# Altium schematic sheet PSU.SchDoc
size A4; SheetNumber: 2; SheetTotal: 2
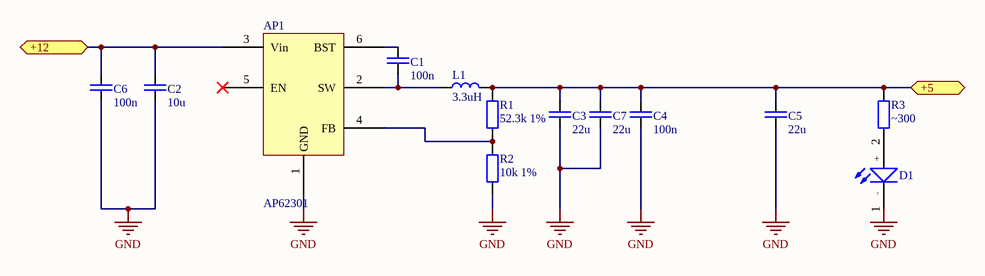
[diagram p0: PSU.SchDoc]

## Parts
AP1  AP62301  [SOT95P280X100-6L]
C1  100n  [C3216_1206I_L]
C2  10u  [C3225_1210I_L]
C3  22u  [C3225_1210I_L]
C4  100n  [C3216_1206I_L]
C5  22u  [C3225_1210I_L]
C6  100n  [C3216_1206I_L]
C7  22u  [C3225_1210I_L]
D1  LED  [LED1608_0603I_L]  (value not drawn)
L1  3.3uH  [INDUCTOR]
R1  52.3k 1%  [R1005_0402i_L]
R2  10k 1%  [R1005_0402i_L]
R3  ~300  [R1005_0402i_L]

## Ports
+5 (bidir), +12 (bidir)

## Nets
GND: AP1.1(GND) C2.2 C3.2 C4.2 C5.2 C6.2 C7.2 D1.1(-) R2.2
+5: C3.1 C4.1 C5.1 C7.1 L1.2 R1.1 R3.1 ; port +5
+12: AP1.3(Vin) C2.1 C6.1 ; port +12
NetAP1_2: AP1.2(SW) C1.2 L1.1
NetAP1_4: AP1.4(FB) R1.2 R2.1
NetAP1_6: AP1.6(BST) C1.1
NetD1_2: D1.2(+) R3.2

Not connected (* = marked no-connect by the designer): AP1 5(EN)*

## Library data of the parts
C1-C7 = C: Capacitor
L1 = L
R1-R3 = R